# EAGLE design Lighting (EAGLE 9.6.2)
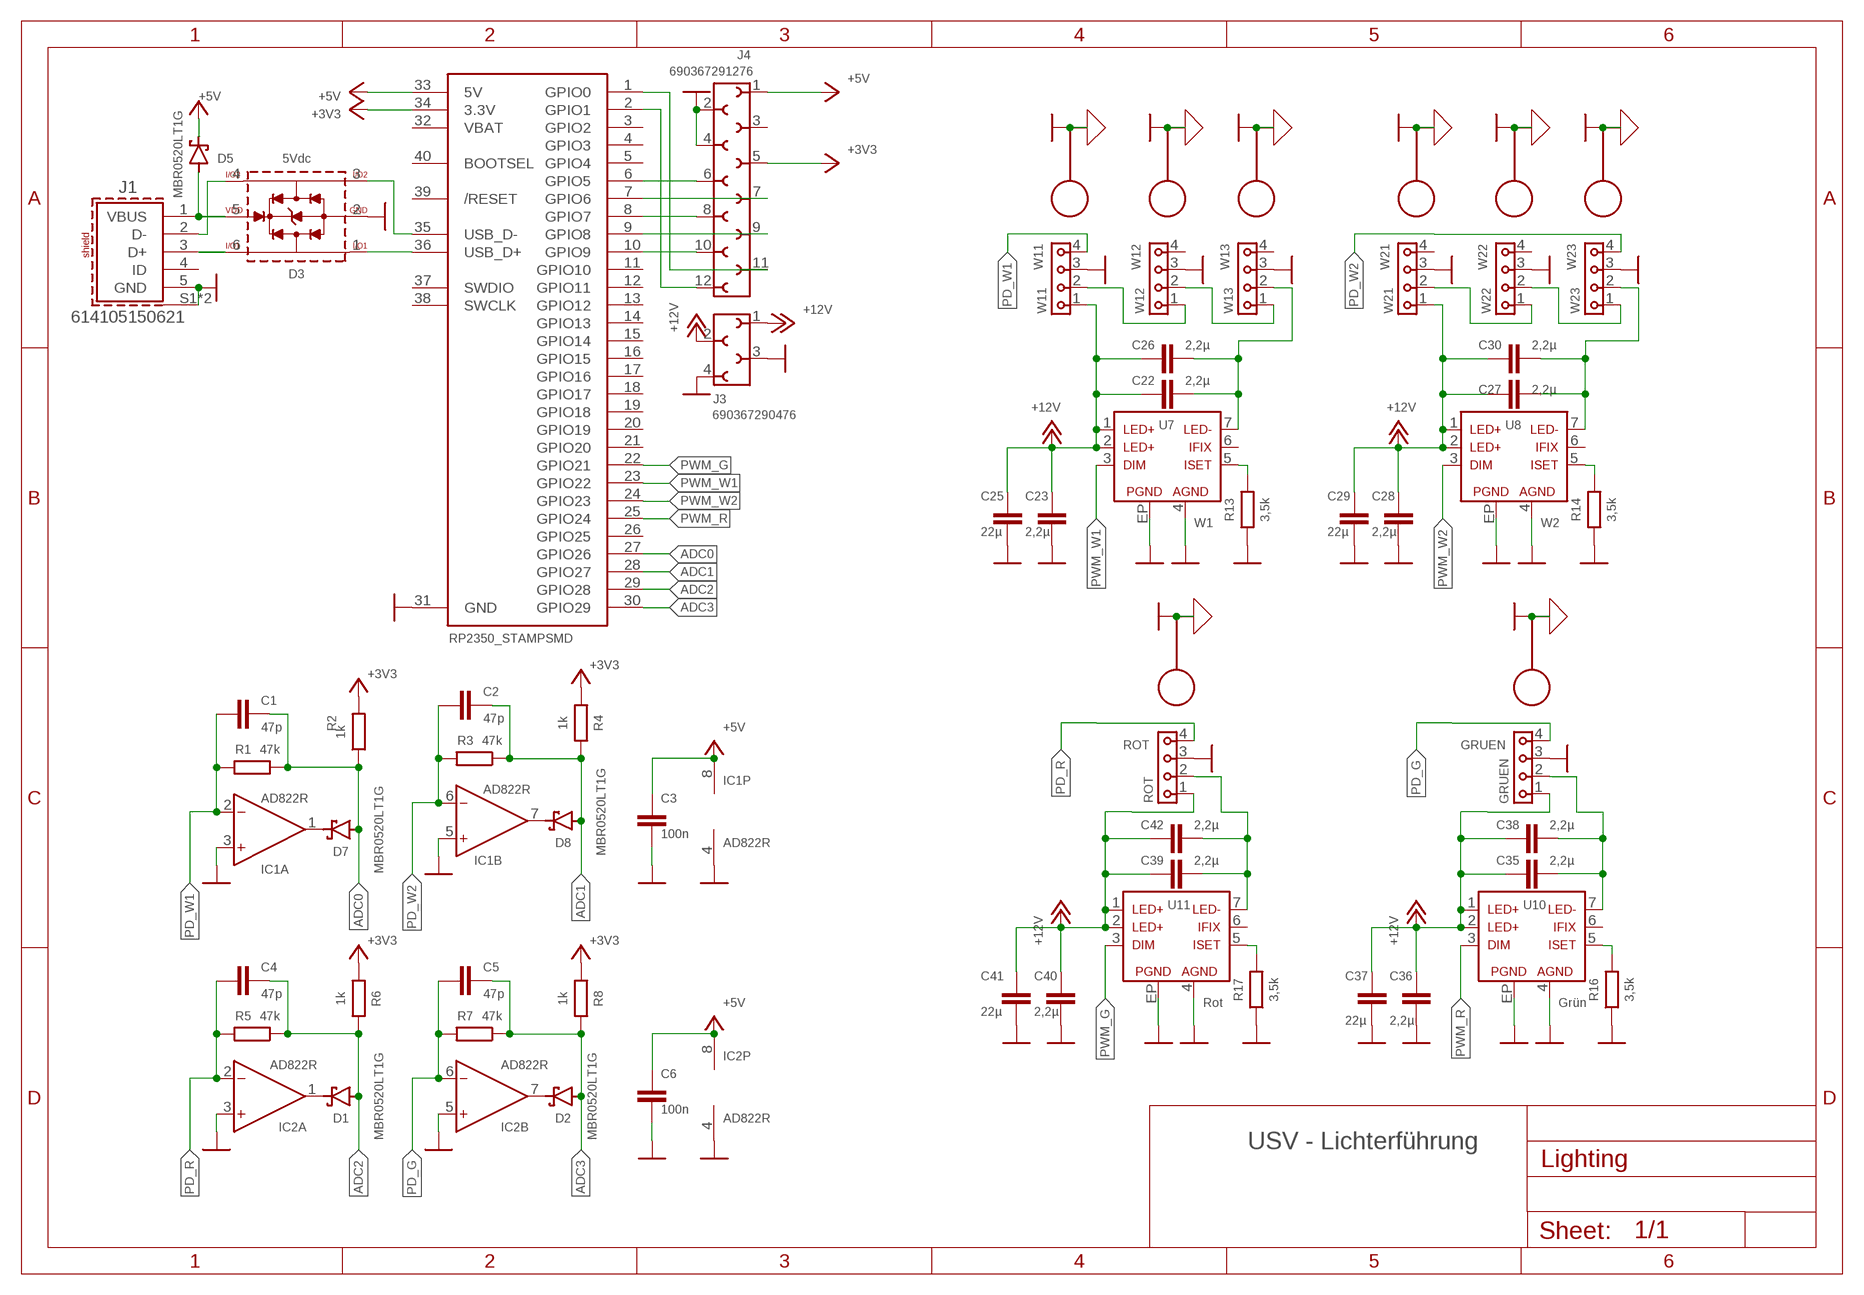
[diagram p0: schematic, sheet 1]

## Parts
C1  47p  C_CHIP-0805(2012-METRIC)  [CAPC2012X110]
C2  47p  C_CHIP-0805(2012-METRIC)  [CAPC2012X110]
C3  100n  C_CHIP-0805(2012-METRIC)  [CAPC2012X110]
C4  47p  C_CHIP-0805(2012-METRIC)  [CAPC2012X110]
C5  47p  C_CHIP-0805(2012-METRIC)  [CAPC2012X110]
C6  100n  C_CHIP-0805(2012-METRIC)  [CAPC2012X110]
C22  2,2µ  C_CHIP-0805(2012-METRIC)  [CAPC2012X110]
C23  2,2µ  C_CHIP-0805(2012-METRIC)  [CAPC2012X110]
C25  22µ  C_CHIP-0805(2012-METRIC)  [CAPC2012X110]
C26  2,2µ  C_CHIP-0805(2012-METRIC)  [CAPC2012X110]
C27  2,2µ  C_CHIP-0805(2012-METRIC)  [CAPC2012X110]
C28  2,2µ  C_CHIP-0805(2012-METRIC)  [CAPC2012X110]
C29  22µ  C_CHIP-0805(2012-METRIC)  [CAPC2012X110]
C30  2,2µ  C_CHIP-0805(2012-METRIC)  [CAPC2012X110]
C35  2,2µ  C_CHIP-0805(2012-METRIC)  [CAPC2012X110]
C36  2,2µ  C_CHIP-0805(2012-METRIC)  [CAPC2012X110]
C37  22µ  C_CHIP-0805(2012-METRIC)  [CAPC2012X110]
C38  2,2µ  C_CHIP-0805(2012-METRIC)  [CAPC2012X110]
C39  2,2µ  C_CHIP-0805(2012-METRIC)  [CAPC2012X110]
C40  2,2µ  C_CHIP-0805(2012-METRIC)  [CAPC2012X110]
C41  22µ  C_CHIP-0805(2012-METRIC)  [CAPC2012X110]
C42  2,2µ  C_CHIP-0805(2012-METRIC)  [CAPC2012X110]
D1  MBR0520LT1G  SCHOTTKY_MBR0520LT1GDO-219  [SODFL3718X115]
D2  MBR0520LT1G  SCHOTTKY_MBR0520LT1GDO-219  [SODFL3718X115]
D3  5Vdc  WE-TVS-HS_SOT563_82400152  [WE-TVS_SOT563]
D5  MBR0520LT1G  SCHOTTKY_MBR0520LT1GDO-219  [SODFL3718X115]
D7  MBR0520LT1G  SCHOTTKY_MBR0520LT1GDO-219  [SODFL3718X115]
D8  MBR0520LT1G  SCHOTTKY_MBR0520LT1GDO-219  [SODFL3718X115]
GRUEN  GRUEN  LED_PLATINE  [LED_PLATINE]
IC1  AD822R  [SO8]
IC2  AD822R  [SO8]
J1  614105150621  [614105150621]
J3  690367290476  [690367290476]
J4  690367291276  [690367291276]
R1  47k  R_CHIP-0805(2012-METRIC)  [RESC2012X65]
R2  1k  R_CHIP-0805(2012-METRIC)  [RESC2012X65]
R3  47k  R_CHIP-0805(2012-METRIC)  [RESC2012X65]
R4  1k  R_CHIP-0805(2012-METRIC)  [RESC2012X65]
R5  47k  R_CHIP-0805(2012-METRIC)  [RESC2012X65]
R6  1k  R_CHIP-0805(2012-METRIC)  [RESC2012X65]
R7  47k  R_CHIP-0805(2012-METRIC)  [RESC2012X65]
R8  1k  R_CHIP-0805(2012-METRIC)  [RESC2012X65]
R13  3,5k  R_CHIP-0805(2012-METRIC)  [RESC2012X65]
R14  3,5k  R_CHIP-0805(2012-METRIC)  [RESC2012X65]
R16  3,5k  R_CHIP-0805(2012-METRIC)  [RESC2012X65]
R17  3,5k  R_CHIP-0805(2012-METRIC)  [RESC2012X65]
ROT  ROT  LED_PLATINE  [LED_PLATINE]
U7  W1  MAGI³C-LDHM_172946001  [MAGI³C-LDHM_172946001]
U8  W2  MAGI³C-LDHM_172946001  [MAGI³C-LDHM_172946001]
U10  Grün  MAGI³C-LDHM_172946001  [MAGI³C-LDHM_172946001]
U11  Rot  MAGI³C-LDHM_172946001  [MAGI³C-LDHM_172946001]
U$1  RP2350_STAMPSMD  [RP2XXX_STAMP_SMD]
W11  W11  LED_PLATINE  [LED_PLATINE]
W12  W12  LED_PLATINE  [LED_PLATINE]
W13  W13  LED_PLATINE  [LED_PLATINE]
W21  W21  LED_PLATINE  [LED_PLATINE]
W22  W22  LED_PLATINE  [LED_PLATINE]
W23  W23  LED_PLATINE  [LED_PLATINE]

## Nets
+3V3: J4.5 R2.2 R4.2 R6.2 R8.2 U$1.34(3.3V)
+5V: C3.1 C6.1 D5.1(C) IC1.8(P:V+) IC2.8(P:V+) J4.1 U$1.33(5V)
+12V: C22.1 C23.1 C25.1 C26.1 C27.1 C28.1 C29.1 C30.1 C35.1 C36.1 C37.1 C38.1 C39.1 C40.1 C41.1 C42.1 GRUEN.1 J3.1 J3.2 ROT.1 U7.1(LED+) U7.2(LED1+) U8.1(LED+) U8.2(LED1+) U10.1(LED+) U10.2(LED1+) U11.1(LED+) U11.2(LED1+) W11.1 W21.1
ADC0: C1.2 D7.2(A) R1.1 R2.1 U$1.27(GPIO26)
ADC1: C2.2 D8.2(A) R3.1 R4.1 U$1.28(GPIO27)
ADC2: C4.2 D1.2(A) R5.1 R6.1 U$1.29(GPIO28)
ADC3: C5.2 D2.2(A) R7.1 R8.1 U$1.30(GPIO29)
D+@1: D3.6(I/O3) J1.3(D+)
D-@1: D3.4(I/O4) J1.2(D-)
D_N: D3.3(I/O2) U$1.35(USB_D-)
D_P: D3.1(I/O1) U$1.36(USB_D+)
GND: C3.2 C6.2 C23.2 C25.2 C28.2 C29.2 C36.2 C37.2 C40.2 C41.2 D3.2(GND) GRUEN.3 GRUEN.5 IC1.3(A:IN+) IC1.4(P:V-) IC1.5(B:IN+) IC2.3(A:IN+) IC2.4(P:V-) IC2.5(B:IN+) J1.5(GND) J1.S1(SHIELD) J1.S2(SHIELD) J3.3 J3.4 J4.2 J4.4 R13.1 R14.1 R16.1 R17.1 ROT.3 ROT.5 U7.4(AGND) U7.EP(PGND) U8.4(AGND) U8.EP(PGND) U10.4(AGND) U10.EP(PGND) U11.4(AGND) U11.EP(PGND) U$1.31(GND) W11.3 W11.5 W12.3 W12.5 W13.3 W13.5 W21.3 W21.5 W22.3 W22.5 W23.3 W23.5
LED-G-: C35.2 C38.2 GRUEN.2 U10.7(LED-)
LED-R-: C39.2 C42.2 ROT.2 U11.7(LED-)
LED-W1-: C22.2 C26.2 U7.7(LED-) W13.2
LED_W2-: C27.2 C30.2 U8.7(LED-) W23.2
N$1: D1.1(C) IC2.1(A:OUT)
N$2: D2.1(C) IC2.7(B:OUT)
N$4: J4.10 U$1.10(GPIO9)
N$5: D7.1(C) IC1.1(A:OUT)
N$6: J4.9 U$1.9(GPIO8)
N$11: J4.8 U$1.8(GPIO7)
N$12: J4.7 U$1.7(GPIO6)
N$13: D8.1(C) IC1.7(B:OUT)
N$14: J4.6 U$1.6(GPIO5)
N$17: R16.2 U10.5(ISET)
N$18: R17.2 U11.5(ISET)
N$20: R13.2 U7.5(ISET)
N$21: J4.12 U$1.2(GPIO1)
N$22: J4.11 U$1.1(GPIO0)
N$25: R14.2 U8.5(ISET)
PD_G: C5.1 GRUEN.4 IC2.6(B:IN-) R7.2
PD_R: C4.1 IC2.2(A:IN-) R5.2 ROT.4
PD_W1: C1.1 IC1.2(A:IN-) R1.2 W11.4
PD_W2: C2.1 IC1.6(B:IN-) R3.2 W23.4
PWM_G: U11.3(DIM) U$1.22(GPIO21)
PWM_R: U10.3(DIM) U$1.25(GPIO24)
PWM_W1: U7.3(DIM) U$1.23(GPIO22)
PWM_W2: U8.3(DIM) U$1.24(GPIO23)
VBUS: D3.5(VDD) D5.2(A) J1.1(VBUS)
W11_W12: W11.2 W12.1
W12_W13: W12.2 W13.1
W21_W22: W21.2 W22.1
W22_W23: W22.2 W23.1
Unconnected: J1.4(ID) J4.3 U7.6(IFIX) U8.6(IFIX) U10.6(IFIX) U11.6(IFIX) U$1.3(GPIO2) U$1.4(GPIO3) U$1.5(GPIO4) U$1.11(GPIO10) U$1.12(GPIO11) U$1.13(GPIO12) U$1.14(GPIO13) U$1.15(GPIO14) U$1.16(GPIO15) U$1.17(GPIO16) U$1.18(GPIO17) U$1.19(GPIO18) U$1.20(GPIO19) U$1.21(GPIO20) U$1.26(GPIO25) U$1.37(SWDIO) U$1.38(SWCLK) U$1.39(/RESET) U$1.40(BOOTSEL) W12.4 W13.4 W21.4 W22.4

## Notes on the sheet
- USV - Lichterführung

## Power pins joined to a net without a drawn wire
VBAT: U$1.32(VBAT)

## Library data of the parts
C1-C6 C22 C23 C25-C30 C35-C42 = Capacitor:C: Capacitor - Generic; CATEGORY: Capacitor
D1 D2 D5 D7 D8 = diode:SCHOTTKY_: Schottky Diode - Popular parts; CATEGORY: Diode; DESCRIPTION: DIODE SCHOTTKY 20V 500MA SOD123; MANUFACTURER: ON Semiconductor; MPN: MBR0520LT1G; SUB-CATEGORY: Schottky
D3 = Eagle_WE-TVS (rev22a):WE-TVS-HS_SOT563_82400152: WE-TVS TVS Diode – High Speed Series Characteristics Low clamping voltage Sturdy design Very low capacitance Flow Thru Design for a simple layout Rail to Rail protection Epoxy flame resistant UL94-V0 RoHS, REACH and free of halogens Applications Very fast data lines USB 2.0 Ethernet PoE VGA Sim Cards Keypads HS = High Speed <https://www.we-online.com/catalog/media/o14883v209%20Family_WE-TVS_HIGHSPEED.jpg> Details see: https://www.we-online.com/catalog/en/WE-TVS-HS Updated by Ella Wu 2019-07-12 2019 (C) Wurth Elektronik; C-CH: 2pF; CHANNELS: 2+1; DATASHEET-URL: https://www.we-online.com/catalog/datasheet/82400152.pdf; IPEAK: 6A; MOUNT: SMT; PART-NUMBER: 82400152; VBR: 6V
GRUEN ROT W11-W13 W21-W23 = LED_Platine_SMD:LED_PLATINE
IC1 IC2 = analog-devices:AD822: Single-Supply, Rail-to-Rail Low Power FET-Input Op Amp Source: http://www.analog.com/static/imported-files/data_sheets/AD822.pdf; MF: ANALOG DEVICES; MPN: AD822BRZ; OC_FARNELL: 1651303
J1 = Eagle_WR-USB (rev25c):614105150621: WR-COM Micro USB 2.0 Type AB Vertical 5 Contacts Kind Properties Durability:10 000 Mating cycles Quality Class:10 000 Mating cycles Connector Type:Micro USB Gender:Receptacle Type:Vertical General Information Operating Temperature:-40up to +105 °C Compliance:RoHS Electrical Properties IR 1:1.8A Working Voltage:30V (AC) Withstanding Voltage:100V (AC) Contact Resistance:30 mΩ Material Properties Insulator Material:LCP Insulator Flammability Rating:UL94 V-0 Color:Black Contact Material:Copper Alloy Contact Plating: Gold Contact Type:Stamped Shielding Material:Stainless Steel Shielding Plating:Matte Tin <https://www.we-online.com/catalog/media/o33043v209%20Family_WR-COM_Micro-USB_Type-AB_614105150621.jpg> Details see: https://www.we-online.com/catalog/en/COM_MICRO_TYPE_AB_VERTICAL/ Updated by Yingchun, Shan 2020-01-16 2020 (C) Würth Elektronik; APPLICATION: Micro USB 2.0; DATASHEET-URL: https://www.we-online.com/redexpert/spec/614105150621?ae; GERDER: Receptacle; INTERFACE-TYPE: Type AB; IR: 1.8A; MOUNT: THT; PACKAGING: Tape and Reel; PART-NUMBER: 614105150621; PINS: 5pcs; TYPE: Vertical; WORKING-VOLTAGE: 30VAC
J3 = Eagle_WR-MM (rev20b):690367290476: WR-MM Female SMT Connector with Latch & Polarization KIND PROPERTIES: Pitch 2.54 mm Gender:Female MATERIAL PROPERTIES: Insulator Material:PA6T Insulator Flammability Rating UL94 V-0 Insulator Color:Red Contact Material :Phosphor Bronze Contact Plating :Mat Tin over Nickel Contact Type: Stamped GENERAL PROPERTIES: Operating Temperature:-40 °C up to +105 °C Compliance Lead free / RoHS ELECTRICAL PROPERTIES: Working Voltage 100 V (AC) Withstanding Voltage:500 V (AC) Contact Resistance: 10 mΩ Insulation Resistance:1000 MΩ PACKAGING PROPERTIES: cULus Approval:E323964 Packaging :Tape and Reel <https://katalog.we-online.com/media/images/v2/o33161v209%20WR-MiMo_69036729xx76.jpg> Details see: Web 1: https://katalog.we-online.com/en/em/MM_1_27_SMT_FEMALE_CONNECTOR_WITH_LATCH_AND_POLARIZATION_69036729XX76_2 Web2: https://katalog.we-online.com/en/em/MM_1_27_SMT_FEMALE_CONNECTOR_WITH_LATCH_AND_POLARIZATION_69036729XX76 Updated by Yingchun,Shan 2019-10-28 2019 (C) Würth Elektronik; DATASHEET-URL: https://www.we-online.com/catalog/datasheet/690367290476.pdf; GENDER: Female; IR: 1.5A; PACKAGING: Tape and Reel; PART-NUMBER: 690367290476; PINS: 4; PITCH: 2.54; TYPE: Straight
J4 = Eagle_WR-MM (rev20b):690367291276: WR-MM Female SMT Connector with Latch & Polarization KIND PROPERTIES: Pitch 2.54 mm Gender:Female MATERIAL PROPERTIES: Insulator Material:PA6T Insulator Flammability Rating UL94 V-0 Insulator Color:Red Contact Material :Phosphor Bronze Contact Plating :Mat Tin over Nickel Contact Type: Stamped GENERAL PROPERTIES: Operating Temperature:-40 °C up to +105 °C Compliance Lead free / RoHS ELECTRICAL PROPERTIES: Working Voltage 100 V (AC) Withstanding Voltage:500 V (AC) Contact Resistance: 10 mΩ Insulation Resistance:1000 MΩ PACKAGING PROPERTIES: cULus Approval:E323964 Packaging :Tape and Reel <https://katalog.we-online.com/media/images/v2/o33161v209%20WR-MiMo_69036729xx76.jpg> Details see: Web 1: https://katalog.we-online.com/en/em/MM_1_27_SMT_FEMALE_CONNECTOR_WITH_LATCH_AND_POLARIZATION_69036729XX76_2 Web2: https://katalog.we-online.com/en/em/MM_1_27_SMT_FEMALE_CONNECTOR_WITH_LATCH_AND_POLARIZATION_69036729XX76 Updated by Yingchun,Shan 2019-10-28 2019 (C) Würth Elektronik; DATASHEET-URL: https://www.we-online.com/catalog/datasheet/690367291276.pdf; GENDER: Female; IR: 1.5A; PACKAGING: Tape and Reel; PART-NUMBER: 690367291276; PINS: 12; PITCH: 2.54; TYPE: Straight
R1-R8 R13 R14 R16 R17 = Resistor:R: Resistor Fixed - Generic; CATEGORY: Resistor; SUB-CATEGORY: Fixed
U7 U8 U10 U11 = Eagle_MAGIC-LDHM (rev19a):MAGI³C-LDHM_172946001: MagI³C-LDHM LED Step Down High Current Module Characteristics Leaded package for easy manufacturing and prototyping Simple layout PWM and analog dimming supported Adjustable LED current Low conducted and radiated EMI (compliant to EN55015) Applications Indoor lighting: Spot light, down light Outdoor lighting: Street light, security light, tunnel light Outdoor lighting: High-bay light, low-bay light <https://katalog.we-online.de/media/images/v2/o55812v209%20Family_LED-Driver_Module_WE-LDHM_7EP.jpg> Details see: https://katalog.we-online.de/en/pm/MAGIC-LDHM-TOP263-7EP <hhttps://katalog.we-online.de/en/pm/MAGIC-LDHM-TOP263-7EP> Updated by Ella Wu, 2019-09-18 2019 (C) Würth Elektronik; DATASHEET-URL: https://katalog.we-online.de/pm/datasheet/172946001.pdf; I-OUTPUT: 450mA; MOUNT: SMT; PART-NUMBER: 172946001; V-INPUT: 4.5-60V; V-OUTPUT: 4.5-60V
U$1 = rp2xxx_stamp:RP2350_STAMP

## Board
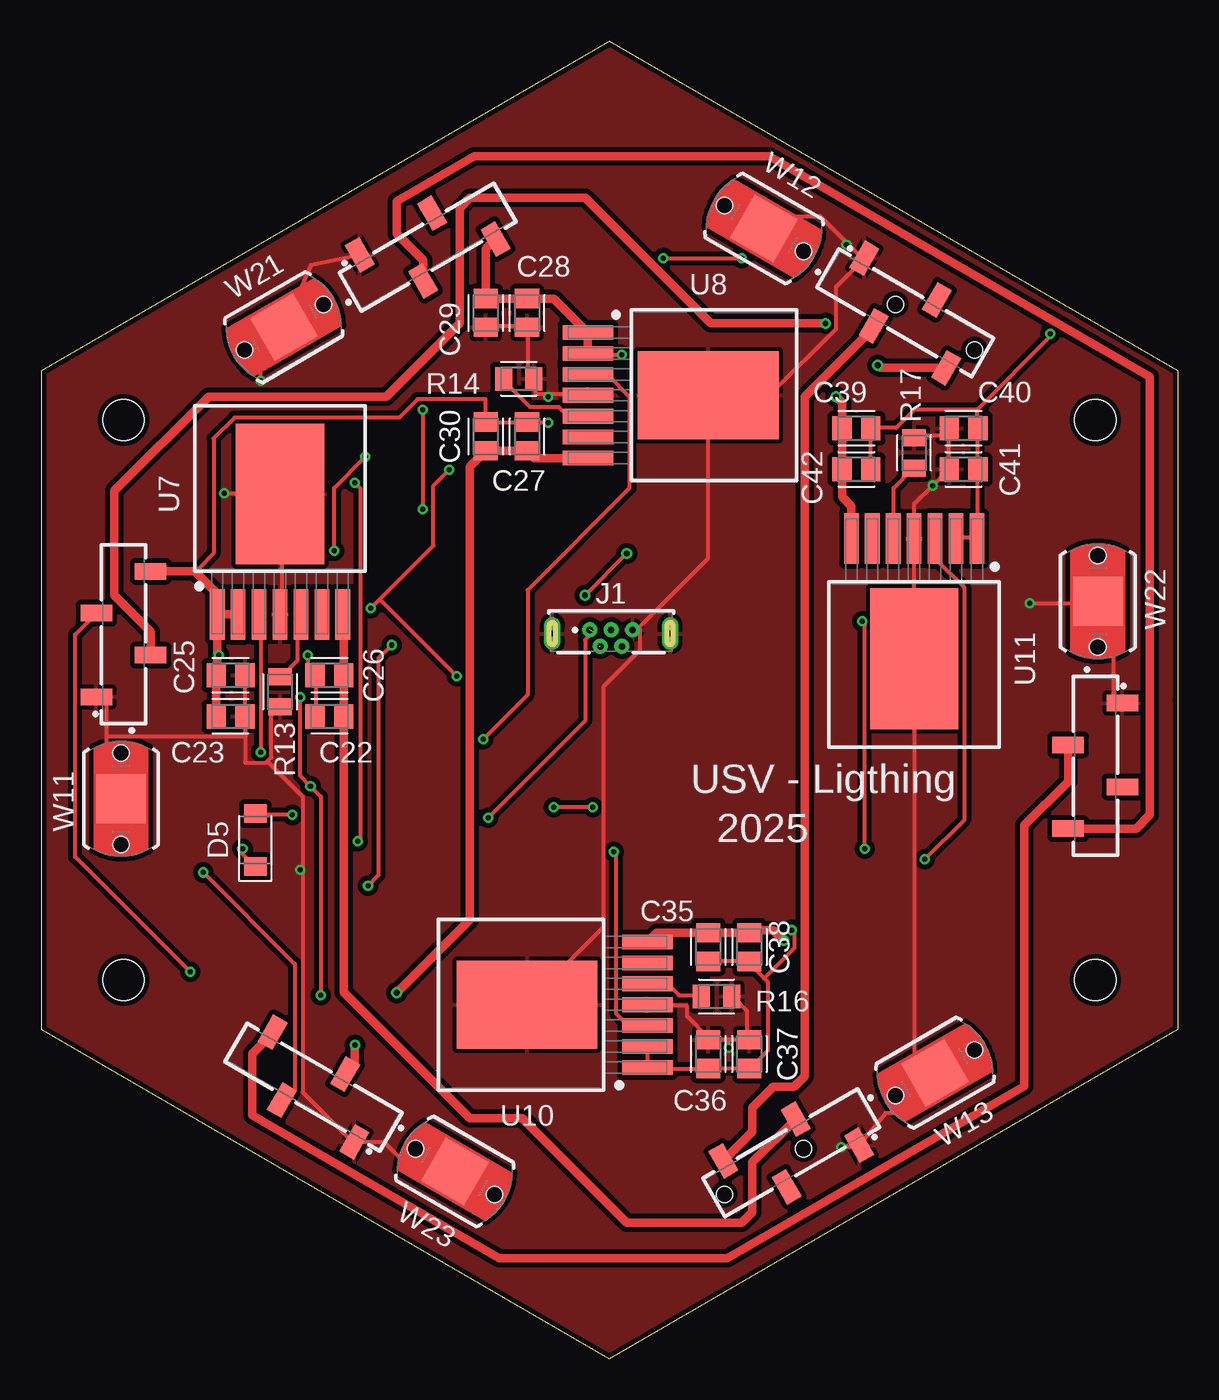
[diagram p1: board, top side]
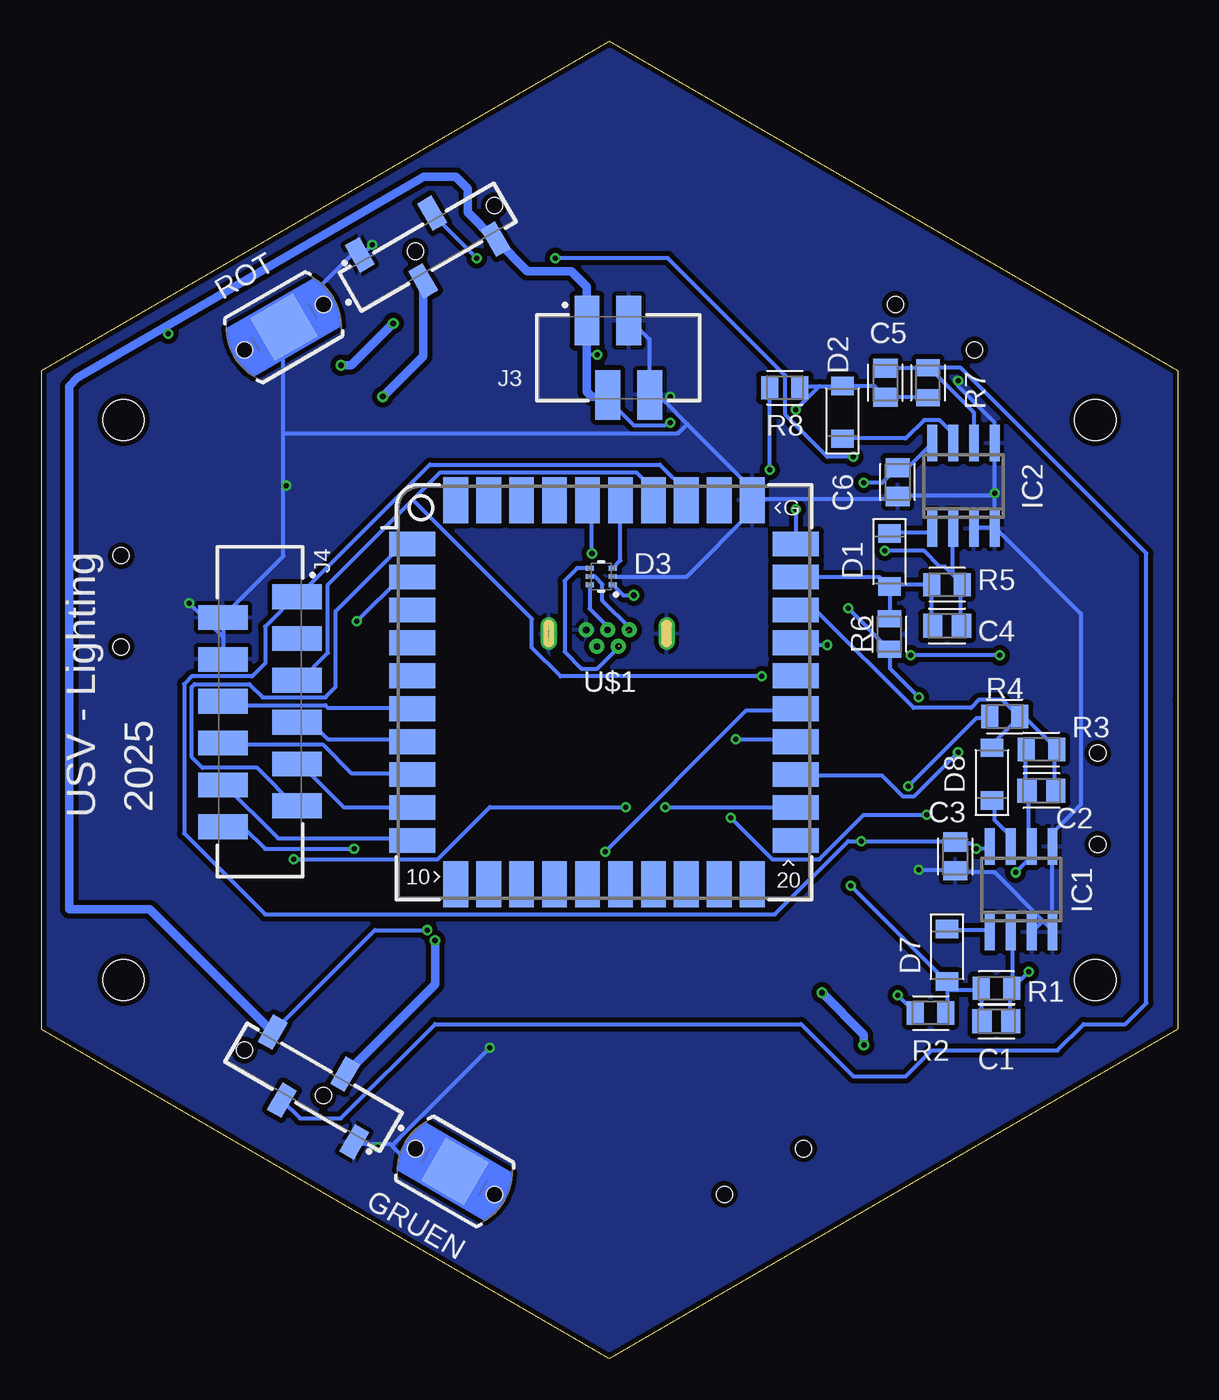
[diagram p2: board, bottom side, seen from below]

Size 69 x 80 mm. Coordinates in mm from the lower left corner, seen from the top.
Outline: 0,60 0,40 0,20 34.5,0 69,20 69,40 69,60 34.5,80 0,60
Copper layers (1*16): Top 0.035mm / dielectric 1.5mm / Bottom 0.035mm
Design rules "Elecrow_2-layer_eagle_rule *": minimum track width 10mil, minimum drill 12mil, track to track 6mil, track to pad 6mil, pad to pad 6mil, via to via 6mil, smd to smd 0mil, copper to edge 10mil, drill to drill 10mil, minimum pad ring 10mil, minimum via ring 6mil, stop-mask expansion 2mil, vias tented up to drill 100mil, thermal gap 10mil
Holes 2.5 mm at 5,57 5,23 64,57 64,23

### Footprints (pad centres in the part's own frame; a part is rotated, then mirrored left to right if it is on the bottom)
CAPC2012X110 = smd 1.165 x 1.465: 1 -0.875,0; 2 0.875,0
SODFL3718X115 = smd 1.115 x 1.361: 1 -1.6,0; 2 1.6,0
WE-TVS_SOT563 = smd 0.3 x 0.5: 1 -0.5,-0.7; 2 0,-0.7; 3 0.5,-0.7; 4 0.5,0.7; 5 0,0.7; 6 -0.5,0.7
LED_PLATINE = smd 1 x 1.91: 1 7.81,-1.645; 2 2.73,-1.645; 3 0.19,1.645; 4 5.27,1.645 | smd 3 x 3: 5 -5.994,0.152 | hole 0.97: -8.764,0.152; -3.224,0.152
SO8 = smd 0.6 x 2.2: 1 -1.905,-2.6; 2 -0.635,-2.6; 3 0.635,-2.6; 4 1.905,-2.6; 5 1.905,2.6; 6 0.635,2.6; 7 -0.635,2.6; 8 -1.905,2.6
614105150621 = drill 0.4: 1 -1.3,0.125; 2 -0.65,-0.875; 3 0,0.125; 4 0.65,-0.875; 5 1.3,0.125 | drill 0.35 pad 1.016 long: S1 -3.575,-0.095; S2 3.575,-0.095
690367290476 = smd 1.5 x 3: 1 1.905,-2.25; 2 0.635,2.25; 3 -0.635,-2.25; 4 -1.905,2.25
690367291276 = smd 1.5 x 3: 1 6.985,-2.25; 2 5.715,2.25; 3 4.445,-2.25; 4 3.175,2.25; 5 1.905,-2.25; 6 0.635,2.25; 7 -0.635,-2.25; 8 -1.905,2.25; 9 -3.175,-2.25; 10 -4.445,2.25; 11 -5.715,-2.25; 12 -6.985,2.25
RESC2012X65 = smd 1.031 x 1.42: 1 -0.919,0; 2 0.919,0
MAGI³C-LDHM_172946001 = smd 3.06 x 0.89: 1 -7.305,3.81; 2 -7.305,2.54; 3 -7.305,1.27; 4 -7.305,0; 5 -7.305,-1.27; 6 -7.305,-2.54; 7 -7.305,-3.81 | smd 8.54 x 5.35: EP 0,0
RP2XXX_STAMP_SMD = smd 2.8 x 1.5: 1 -11.65,9; 2 -11.65,7; 3 -11.65,5; 4 -11.65,3; 5 -11.65,1; 6 -11.65,-1; 7 -11.65,-3; 8 -11.65,-5; 9 -11.65,-7; 10 -11.65,-9; 21 11.65,-9; 22 11.65,-7; 23 11.65,-5; 24 11.65,-3; 25 11.65,-1; 26 11.65,1; 27 11.65,3; 28 11.65,5; 29 11.65,7; 30 11.65,9 | smd 1.5 x 2.8: 11 -9,-11.65; 12 -7,-11.65; 13 -5,-11.65; 14 -3,-11.65; 15 -1,-11.65; 16 1,-11.65; 17 3,-11.65; 18 5,-11.65; 19 7,-11.65; 20 9,-11.65; 31 9,11.65; 32 7,11.65; 33 5,11.65; 34 3,11.65; 35 1,11.65; 36 -1,11.65; 37 -3,11.65; 38 -5,11.65; 39 -7,11.65; 40 -9,11.65

### Placement (x,y rotation side)
C1  11,20.5 180 bottom
C2  8.27,34.5 0 bottom
C3  13.5,30.5 270 bottom
C4  14,44.5 180 bottom
C5  17.74,59.26 270 bottom
C6  17,53.23 270 bottom
C22  17.5,39 0 top
C23  11.5,39 0 top
C25  11.5,41.5 0 top
C26  17.5,41.5 0 top
C27  29.5,56 270 top
C28  29.5,63.5 270 top
C29  27,63.5 270 top
C30  27,56 270 top
C35  40.5,25 90 top
C36  40.5,18.5 90 top
C37  43,18.5 90 top
C38  43,25 90 top
C39  49.5,56.5 180 top
C40  56,56.5 180 top
C41  56,54 180 top
C42  49.5,54 180 top
D1  17.5,48.5 270 bottom
D2  20.35,57.46 90 bottom
D3  35,47.5 90 bottom
D5  13,31.5 90 top
D7  14,24.5 270 bottom
D8  11.27,35.5 90 bottom
GRUEN  49,14.5 150 bottom
IC1  9.5,28.5 0 bottom
IC2  13,53 0 bottom
J1  34.61,44.13 0 top
J3  33.96,60.78 180 bottom
J4  55.72,39.29 90 bottom
R1  11,22.5 0 bottom
R2  15,21 180 bottom
R3  8.27,37 180 bottom
R4  10.5,39 180 bottom
R5  14,47 0 bottom
R6  17.5,44 270 bottom
R7  15.16,59.26 90 bottom
R8  23.85,58.96 180 bottom
R13  14.5,40.5 90 top
R14  29,59.5 180 top
R16  41,22 180 top
R17  53,55 270 top
ROT  49,65.5 30 bottom
U7  14.5,52.5 90 top
U8  40.5,58.5 0 top
U10  29.5,21.5 180 top
U11  53,42.5 270 top
U$1  34.83,40.47 0 bottom
W11  5,40 90 top
W12  49,65.5 330 top
W13  49,14.5 210 top
W21  20,65.5 30 top
W22  64,40 270 top
W23  20,14.5 150 top

### Tracks (layer width: path | path; a pad name or v marks a point on that pad's centre or on a via)
+3V3  (via drill 0.3)
  Top 0.254: v16.99,22.07 16.99,34.13 v16.35,34.77 15.72,35.4 v15.72,40.16 | v24.77,53.98 23.81,53.02 23.81,49.37 20.56,46.12 | v20,45.56 20.56,46.12 | v25.24,41.43 20.64,46.04 20.56,46.12
  Bottom 0.254: 46.43,52.15 51.59,46.99 51.59,42.86 53.34,41.12 J4.5 | 46.43,52.15 44.77,53.82 32.86,53.82 31.91,52.86 31.91,52.23 U$1.34 | v16.99,22.07 16.03,21.11 R2.2 | v16.35,34.77 12.22,38.89 11.43,38.89 R4.2 | v15.72,40.16 17.46,41.91 17.46,43.02 R6.2 17.62,43.18 v20,45.56 | v24.77,53.98 24.77,58.9 R8.2 | v25.24,41.43 37.47,41.43 39.21,43.18 39.21,44.93 46.35,52.07 46.43,52.15
+5V  (via drill 0.3)
  Top 0.254: v12.22,30.96 12.22,30.64 12.86,30 D5.1 | v19.21,31.43 19.37,31.59 19.37,52.86 v19.05,53.18
  Bottom 0.254: IC1.8 11.43,30.96 v12.22,30.96 12.54,31.27 13.49,31.27 C3.1 13.65,31.43 v19.21,31.43 20,31.43 24.45,26.99 55.4,26.99 60.33,31.91 60.33,40.96 59.85,41.43 56.2,41.43 55.4,42.23 55.4,44.45 53.5,46.35 J4.1 53.34,46.35 45.4,54.29 31.43,54.29 29.84,52.7 29.84,52.23 U$1.33 | IC2.8 14.92,55.56 16.35,54.13 16.99,54.13 C6.1 17.14,53.98 17.94,53.18 v19.05,53.18
+12V  (via drill 0.3)
  Top 0.254: U11.2 55.56,49.85 56.67,49.85 U11.1 56.83,49.85 56.83,53.98 C41.1 56.83,54.13 56.83,56.36 C40.1 56.83,56.52 56.83,57.63 | C42.1 50.32,54.13 50.32,56.36 C39.1 50.48,56.52 51.91,56.52 53.02,57.63 56.83,57.63 | C35.1 40.64,24.13 42.86,24.13 C38.1 43.02,23.97 43.89,23.1 | 43.89,23.1 44.13,22.86 44.13,18.73 43.02,17.62 C37.1 42.86,17.62 40.64,17.62 C36.1 40.48,17.62 36.83,17.62 U10.1 36.83,17.78 36.83,18.89 U10.2 | C22.1 16.67,39.05 16.67,41.43 C26.1 16.51,41.59 16.19,41.91 v16.19,42.7 | v10.79,42.7 10.69,42.7 | v30.8,56.83 29.53,56.83 C27.1 29.37,56.83 27.15,56.83 C30.1 26.99,56.99 26.99,58.26 22.86,58.26 21.75,57.15 11.75,57.15 10.48,55.88 10.48,48.9 9.53,47.94 9.37,47.78 | v35.24,60.96 33.34,60.96 U8.2 | v45.56,26.04 45.72,25.88 45.72,24.92 43.97,23.18 43.89,23.1 | 56.83,57.63 61.28,62.07 v61.28,62.23
  Top 0.508: W21.1 27,67.39 C29.1 C28.1 31.13,64.38 U8.1 U8.2 | W11.1 9.34,47.81 9.37,47.78 10.79,46.35 10.79,45.3 U7.1 | U7.1 U7.2 | U7.1 10.69,42.7 10.69,41.56 C25.1 C23.1
  Bottom 0.254: v10.79,42.7 v16.19,42.7 | v30.8,56.83 30.96,56.83 31.11,56.67 33.02,56.67 34.61,58.26 J3.2 | v35.24,60.96 35.72,60.96 35.87,60.96 | v45.56,26.04 48.74,26.04 54.77,20 GRUEN.1 | v61.28,62.23 61.44,62.39 61.56,62.6
  Bottom 0.508: J3.2 34.7,58.42 35.56,58.42 35.87,58.73 35.87,60.96 J3.1 35.87,65.08 36.83,66.04 39.47,66.04 ROT.1 41.49,67.98 43.11,69.6 43.11,71.05 43.81,71.75 45.77,71.75 61.56,62.6 66.8,59.56 67.31,59.05 67.31,27.3 62.42,27.3 GRUEN.1
ADC0  (via drill 0.3)
  Top 0.254: v21.27,43.34 20.48,42.55 20.48,29.37 v19.84,28.73
  Bottom 0.254: 13.97,22.38 13.97,21.11 R2.1 | 13.97,22.38 13.97,22.86 D7.2 | C1.2 11.91,20.64 11.91,22.38 R1.1 12.06,22.38 13.97,22.38 | 13.97,22.38 D7.2 | v21.27,43.34 23.18,43.34 U$1.27 | v19.84,28.73 14.13,23.02 D7.2
ADC1
  Bottom 0.254: C2.2 7.46,34.61 7.46,36.99 R3.1 7.46,37.15 9.21,38.89 9.53,38.89 R4.1 | D8.2 11.11,37.15 11.11,37.47 9.68,38.89 R4.1 | U$1.28 23.18,45.4 21.91,45.4 16.03,39.53 12.54,39.53 12.06,40.01 10.64,40.01 9.68,39.05 R4.1
ADC2
  Bottom 0.254: D1.2 17.46,46.83 17.46,44.93 R6.1 | R5.1 14.92,44.61 C4.2 | R5.1 | R5.1 17.46,46.99 D1.2 | U$1.29 18.1,47.47 17.62,46.99 D1.2
ADC3  (via drill 0.3)
  Top 0.254: v23.18,57.63 v23.18,51.59
  Bottom 0.254: 21.75,59.05 22.86,59.05 R8.1 | 21.75,59.05 20.48,59.05 D2.2 20.32,59.05 18.41,59.05 17.78,58.42 C5.2 17.62,58.42 15.24,58.42 R7.1 | v23.18,51.59 23.18,49.53 U$1.30 | 21.75,59.05 v23.18,57.63
D+@1
  Bottom 0.254: D3.6 35.7,45.54 34.53,44.38 J1.3
D-@1  (1 unrouted)
  Bottom 0.254: 35.73,48.02 35.72,48.02 D3.4 36.45,48 37.22,47.23 37.22,42.94 36.2,41.91 35.24,41.91 33.88,43.27
D_N
  Bottom 0.254: D3.3 33.83,48.47 U$1.35
D_P  (via drill 0.35)
  Top 0.254: v35.56,48.9 v33.02,46.35
  Bottom 0.254: D3.1 33.66,46.35 v33.02,46.35 | v35.56,48.9 35.56,51.85 U$1.36
GND  (via drill 0.3)
  Top 0.254: 48.97,67.71 47.31,69.37 43.97,69.37 43.97,68.74 W12.5 | 48.97,67.71 49.85,66.83 W12.3 49.85,66.67 48.26,65.09 48.26,62.55 44.29,58.58 40.64,58.58 U8.EP 40.48,58.42 40.48,48.58 36.2,44.29 | 36.35,44.29 36.35,43.02 34.13,40.8 34.13,26.19 29.53,21.59 U10.EP | W23.5 25.08,11.27 25.08,10.95 23.02,10.95 20.8,13.17 W23.3 18.89,13.18 15.88,16.19 15.88,29.69 | 3.97,37.78 3.97,34.92 4.76,34.13 W11.5 | 3.97,37.78 3.97,39.69 3.49,40.16 W11.3 | 13.73,36.27 13.65,36.2 12.38,36.2 12.38,37.78 | 13.73,36.27 13.97,36.51 13.97,39.05 14.45,39.53 R13.1 | 12.38,37.78 12.38,38.89 C23.2 12.38,39.05 12.38,41.43 C25.2 | 12.38,37.78 3.97,37.78 | 15.88,29.69 15.88,34.13 13.81,36.2 13.73,36.27 | 15.88,29.69 v15.72,29.69 | C29.2 27.15,62.71 29.37,62.71 C28.2 29.53,62.55 29.53,59.85 29.84,59.53 R14.1 30,59.37 30,58.58 30.8,58.58 | 30.8,58.58 33.18,58.58 U8.4 | v30.8,58.42 30.8,58.58 | U7.4 14.61,45.24 14.61,52.39 U7.EP 14.45,52.55 v11.11,52.55 | W21.3 16.67,66.48 16.39,66.42 16.36,66.36 W21.5 14.61,62.55 13.34,61.28 v13.34,59.37 | W22.3 65.56,39.85 65.09,40.32 65.09,45.09 64.29,45.88 W22.5 64.14,45.88 v60.01,45.88 | R16.1 42.07,21.91 42.86,21.11 42.86,19.53 C37.2 42.86,19.37 41.75,19.37 | 41.75,19.37 40.64,19.37 C36.2 40.48,19.53 39.21,20.8 39.21,21.43 36.83,21.43 U10.4 | v48.58,12.86 49.53,12.86 W13.3 51.27,14.92 52.86,14.92 52.86,16.03 54.13,17.3 W13.5 54.13,17.46 53.02,18.57 53.02,42.39 U11.EP 53.02,42.55 53.02,49.69 U11.4 53.02,49.85 53.02,51.91 v54.13,53.02 55.09,53.98 C41.2 55.09,54.13 55.09,56.04 | v41.75,18.89 41.75,19.37 | 55.09,56.04 53.02,56.04 R17.1 | 55.09,56.04 55.09,56.36 C40.2 55.09,56.04
  Top 0.254: v48.9,67.63 48.97,67.71
  Bottom 0.254: 8.18,26.59 7.62,26.04 IC1.4 7.62,26.19 7.62,30.96 IC1.5 7.46,31.11 7.46,32.07 5.87,33.66 5.87,45.24 10.95,50.32 IC2.4 | 8.18,26.59 11.11,29.53 13.49,29.53 C3.2 13.65,29.69 v15.72,29.69 | IC1.3 8.73,26.04 8.26,26.51 8.18,26.59 | J3.3 33.18,63.02 32.07,61.91 32.07,58.58 J3.4 31.91,58.42 31.43,58.42 31.11,58.1 | D3.2 34.29,47.47 29.84,47.47 25.88,51.44 25.88,52.07 U$1.31 | 25.24,52.23 25.72,52.23 U$1.31 | 25.24,52.23 17.14,52.23 C6.2 16.99,52.39 11.11,52.39 | 25.24,52.23 29.77,56.75 | 29.77,56.75 31.11,58.1 | 25.24,52.23 U$1.31 | 31.11,58.1 v30.8,58.42 | 11.11,50.48 12.22,50.48 IC2.3 | 11.11,50.48 IC2.4 | 11.11,50.48 11.11,52.39 | 11.11,52.39 v11.11,52.55 | v11.11,52.55 11.11,55.56 IC2.5 11.11,55.72 11.11,56.83 13.34,59.05 v13.34,59.37 | 11.11,50.48 IC2.4 | 11.11,52.39 v11.11,52.55 | 57.94,43.81 57.94,44.93 J4.2 57.94,45.09 54.29,48.74 54.29,53.02 | 57.94,43.81 57.94,42.55 J4.4 | 57.94,43.81 v60.01,45.88 | 54.29,53.02 54.29,56.2 | 54.29,56.2 54.29,62.55 ROT.5 54.13,62.71 54.13,63.02 50.16,66.99 49.69,66.99 ROT.3 49.53,66.99 v48.9,67.63 | 48.58,13.02 47.78,13.02 47.7,12.94 | 48.58,13.02 49.85,13.02 GRUEN.3 | 47.7,12.94 46.2,11.43 43.97,11.43 GRUEN.5 | v48.58,12.86 48.58,13.02 | v41.75,18.89 47.62,13.02 47.7,12.94 | v54.13,53.02 54.29,53.02 | 54.29,56.2 30.32,56.2 29.84,56.67 29.77,56.75
  pour Top (isolate 0.305): 0,59.69 34.29,80.01 68.58,60.33 69.22,20.32 34.29,0 0,19.68
  pour Bottom (isolate 0.305): 0,59.69 34.29,80.01 68.58,60.33 69.22,20.32 34.29,0 0,19.68
LED-G-  (via drill 0.35)
  Top 0.508: U10.7 37.37,25.88 C35.2 C38.2 43.16,26.04 44.45,26.04 v45.09,25.4
  Bottom 0.508: v45.09,25.4 45.09,22.75 GRUEN.2
LED-R-  (via drill 0.35)
  Top 0.508: U11.7 49.19,51.77 48.62,52.34 C42.2 C39.2 48.62,58.05 v48.26,58.42
  Bottom 0.508: v48.26,58.42 45.81,60.87 ROT.2
LED-W1-
  Top 0.508: W13.2 43.18,11.93 43.18,8.89 42.55,8.26 35.56,8.26 29.21,14.61 26.04,14.61 18.38,22.27 C22.2 C26.2 18.38,44.41 18.41,44.45 18.41,45.09 U7.7
LED_W2-  (via drill 0.35)
  Top 0.508: U8.7 29.93,54.69 C27.2 C30.2 26.04,54.16 26.04,53.34 26.04,26.67 v21.59,22.23 | W23.2 19.05,17.88 v19.05,19.05
  Bottom 0.508: v21.59,22.23 19.05,19.68 v19.05,19.05
N$1
  Bottom 0.254: D1.1 17.46,50.16 15.08,50.16 14.92,50.32 IC2.1
N$2
  Bottom 0.254: D2.1 20.32,55.88 16.51,55.88 15.4,56.99 14.45,56.99 13.65,56.2 13.65,55.72 IC2.7
N$4
  Bottom 0.254: U$1.10 46.51,31.59 54.61,31.59 57.94,34.92 J4.10
N$5
  Bottom 0.254: D7.1 13.97,26.04 11.43,26.04 IC1.1
N$6
  Bottom 0.254: U$1.9 46.51,33.5 50.64,33.5 53.34,36.2 J4.9
N$11
  Bottom 0.254: U$1.8 46.51,35.56 50.16,35.56 51.91,37.31 57.94,37.31 J4.8
N$12
  Bottom 0.254: U$1.7 46.51,37.62 51.59,37.62 52.55,38.58 53.34,38.58 J4.7
N$13
  Bottom 0.254: D8.1 11.11,33.81 11.11,32.7 10.16,31.75 10.16,31.11 IC1.7
N$14
  Bottom 0.254: U$1.6 46.51,39.53 51.59,39.53 51.75,39.69 57.78,39.69 57.94,39.85 J4.6
N$17
  Top 0.254: R16.2 40.01,22.07 38.73,22.07 38.1,22.7 36.83,22.7 U10.5
N$18
  Top 0.254: R17.2 52.86,53.98 51.75,52.86 51.75,49.85 U11.5
N$20
  Top 0.254: R13.2 14.61,41.43 15.56,42.39 15.56,44.93 15.72,45.09 U7.5
N$21  (via drill 0.3)
  Top 0.254: v49.85,44.77 50.01,44.61 v50.01,30.96
  Bottom 0.254: v49.85,44.77 47.15,47.47 46.51,47.47 U$1.2 | v50.01,30.96 55.4,30.96 56.67,32.23 57.94,32.23 J4.12
N$22
  Bottom 0.254: U$1.1 46.51,49.37 47.15,49.37 51.12,45.4 51.12,40.8 51.75,40.16 55.56,40.16 56.36,40.96 59.69,40.96 59.85,40.8 59.85,36.51 59.21,35.88 55.88,35.88 53.5,33.5 J4.11
N$25
  Top 0.254: R14.2 28.1,59.37 29.69,57.78 31.43,57.78 31.91,57.31 33.18,57.31 U8.5
PD_G
  Bottom 0.254: R7.2 15.24,60.17 17.62,60.17 C5.1 | 15.08,60.17 13.18,60.17 1.91,48.9 1.91,21.59 3.17,20.32 5.71,20.32 7.3,18.73 14.92,18.73 16.51,17.14 19.68,17.14 21.59,19.05 22.86,20.32 45.09,20.32 50.8,14.61 53.28,14.61 GRUEN.4 54.29,15.56 | 15.08,60.17 R7.2 | 15.08,60.17 12.38,57.47 12.38,55.72 IC2.6 | 15.08,60.17 R7.2
PD_R  (via drill 0.3)
  Top 0.254: v37.78,66.83 v42.55,66.83 | v19.68,54.77 17.78,52.86 v17.78,49.05
  Bottom 0.254: C4.1 13.18,44.61 13.18,46.99 R5.2 13.18,47.15 13.73,47.7 | v42.55,66.83 45.24,69.53 ROT.4 | v37.78,66.83 30.96,66.83 23.81,59.69 23.81,57.31 21.27,54.77 v19.68,54.77 | v17.78,49.05 15.4,49.05 14.45,48.1 14.13,48.1 13.73,47.7 | IC2.2 13.65,50.32 13.65,47.78 13.73,47.7
PD_W1  (via drill 0.3)
  Top 0.254: v9.05,23.5 2.06,30.48 2.06,43.97 3.33,45.24 W11.4
  Bottom 0.254: R1.2 10.16,22.38 10.16,20.64 C1.1 | v9.05,23.5 10,22.54 R1.2 | IC1.2 10,25.88 10,22.7 R1.2
PD_W2  (via drill 0.3)
  Top 0.254: v9.84,29.53 15.4,23.97 15.4,16.35 14.76,15.72 W23.4
  Bottom 0.254: R3.2 9.21,36.99 9.21,34.61 C2.1 9.05,34.45 9.05,30.48 IC1.6 8.89,30.96 8.89,30.48 v9.84,29.53
PWM_G  (via drill 0.3)
  Top 0.254: v33.5,33.5 v31.11,33.5 | v53.66,30.32 56.04,32.7 56.04,46.83 54.29,48.58 54.29,49.69 U11.3
  Bottom 0.254: v31.11,33.5 23.34,33.5 U$1.22 | v33.5,33.5 41.75,33.5 44.93,30.32 v53.66,30.32
PWM_R  (via drill 0.3)
  Top 0.254: v34.77,30.8 34.92,30.64 34.92,20.95 35.56,20.32 36.67,20.32 U10.3
  Bottom 0.254: v34.77,30.8 26.19,39.37 23.34,39.37 U$1.25
PWM_W1  (via drill 0.3)
  Top 0.254: v13.34,36.83 13.34,45.09 U7.3
  Bottom 0.254: v13.34,36.83 16.03,34.13 16.67,34.13 17.94,35.4 23.18,35.4 U$1.23
PWM_W2  (via drill 0.3)
  Top 0.254: v26.83,37.62 29.53,40.32 29.53,46.67 35.72,52.86 35.72,58.42 34.45,59.69 33.34,59.69 U8.3
  Bottom 0.254: v26.83,37.62 23.34,37.62 U$1.24
VBUS  (via drill 0.3)  (1 unrouted)
  Top 0.254: v15.24,33.02 13.02,33.02 D5.2 | v27.15,32.86 33.02,38.73 33.02,43.66 33.5,44.13
  Bottom 0.254: D3.5 35.41,47.5 34.92,47.02 34.92,46.04 33.23,44.34 J1.1 | v15.24,33.02 19.05,33.02 21.75,30.32 24.61,30.32 v27.15,32.86
W11_W12  (via drill 0.35)
  Top 0.508: W11.2 6.64,44.16 4.45,46.35 4.45,52.7 10.16,58.42 20.95,58.42 25.4,62.87 25.4,69.85 26.04,70.48 33.02,70.48 39.37,64.14 40.64,62.87 v47.62,62.87 | W12.1 50.95,60.17 v50.8,60.33
  Bottom 0.508: v50.8,60.33 50.16,60.33 v47.62,62.87
W12_W13
  Top 0.508: W13.1 43.18,13.79 43.18,15.24 44.45,16.51 45.72,16.51 46.35,17.14 46.35,58.42 50.54,62.61 W12.2
W21_W22
  Top 0.508: W22.1 66.48,32.19 67.31,33.02 67.31,59.63 44.2,73.03 26.31,73.03 21.59,70.29 21.59,68.31 23.19,66.71 W21.2
W22_W23
  Top 0.508: W22.2 62.35,35.05 59.69,32.38 59.69,16.56 41.65,6.1 27.82,6.1 12.81,14.8 12.81,18.53 14.06,19.77 | W23.1 14.06,19.77 | 14.06,19.77 13.02,18.73

### Text on the board
tNames: USV - Ligthing | 2025
bNames: USV - Lighting | 2025